# Altium schematic sheet Prophesse Sensor v 1.5.SchDoc: Davis Interface board
size A3; Date: 15/08/2019; DrawnBy: Paras Karki; Organization: ICNS, MARCS Institute; Address1: Werrington South Campus, Great Western Highway; Address2: Werrington, NSW, 2747; DocumentNumber: FN_dav_int; Revision: 1.0; SheetNumber: 1; SheetTotal: 1
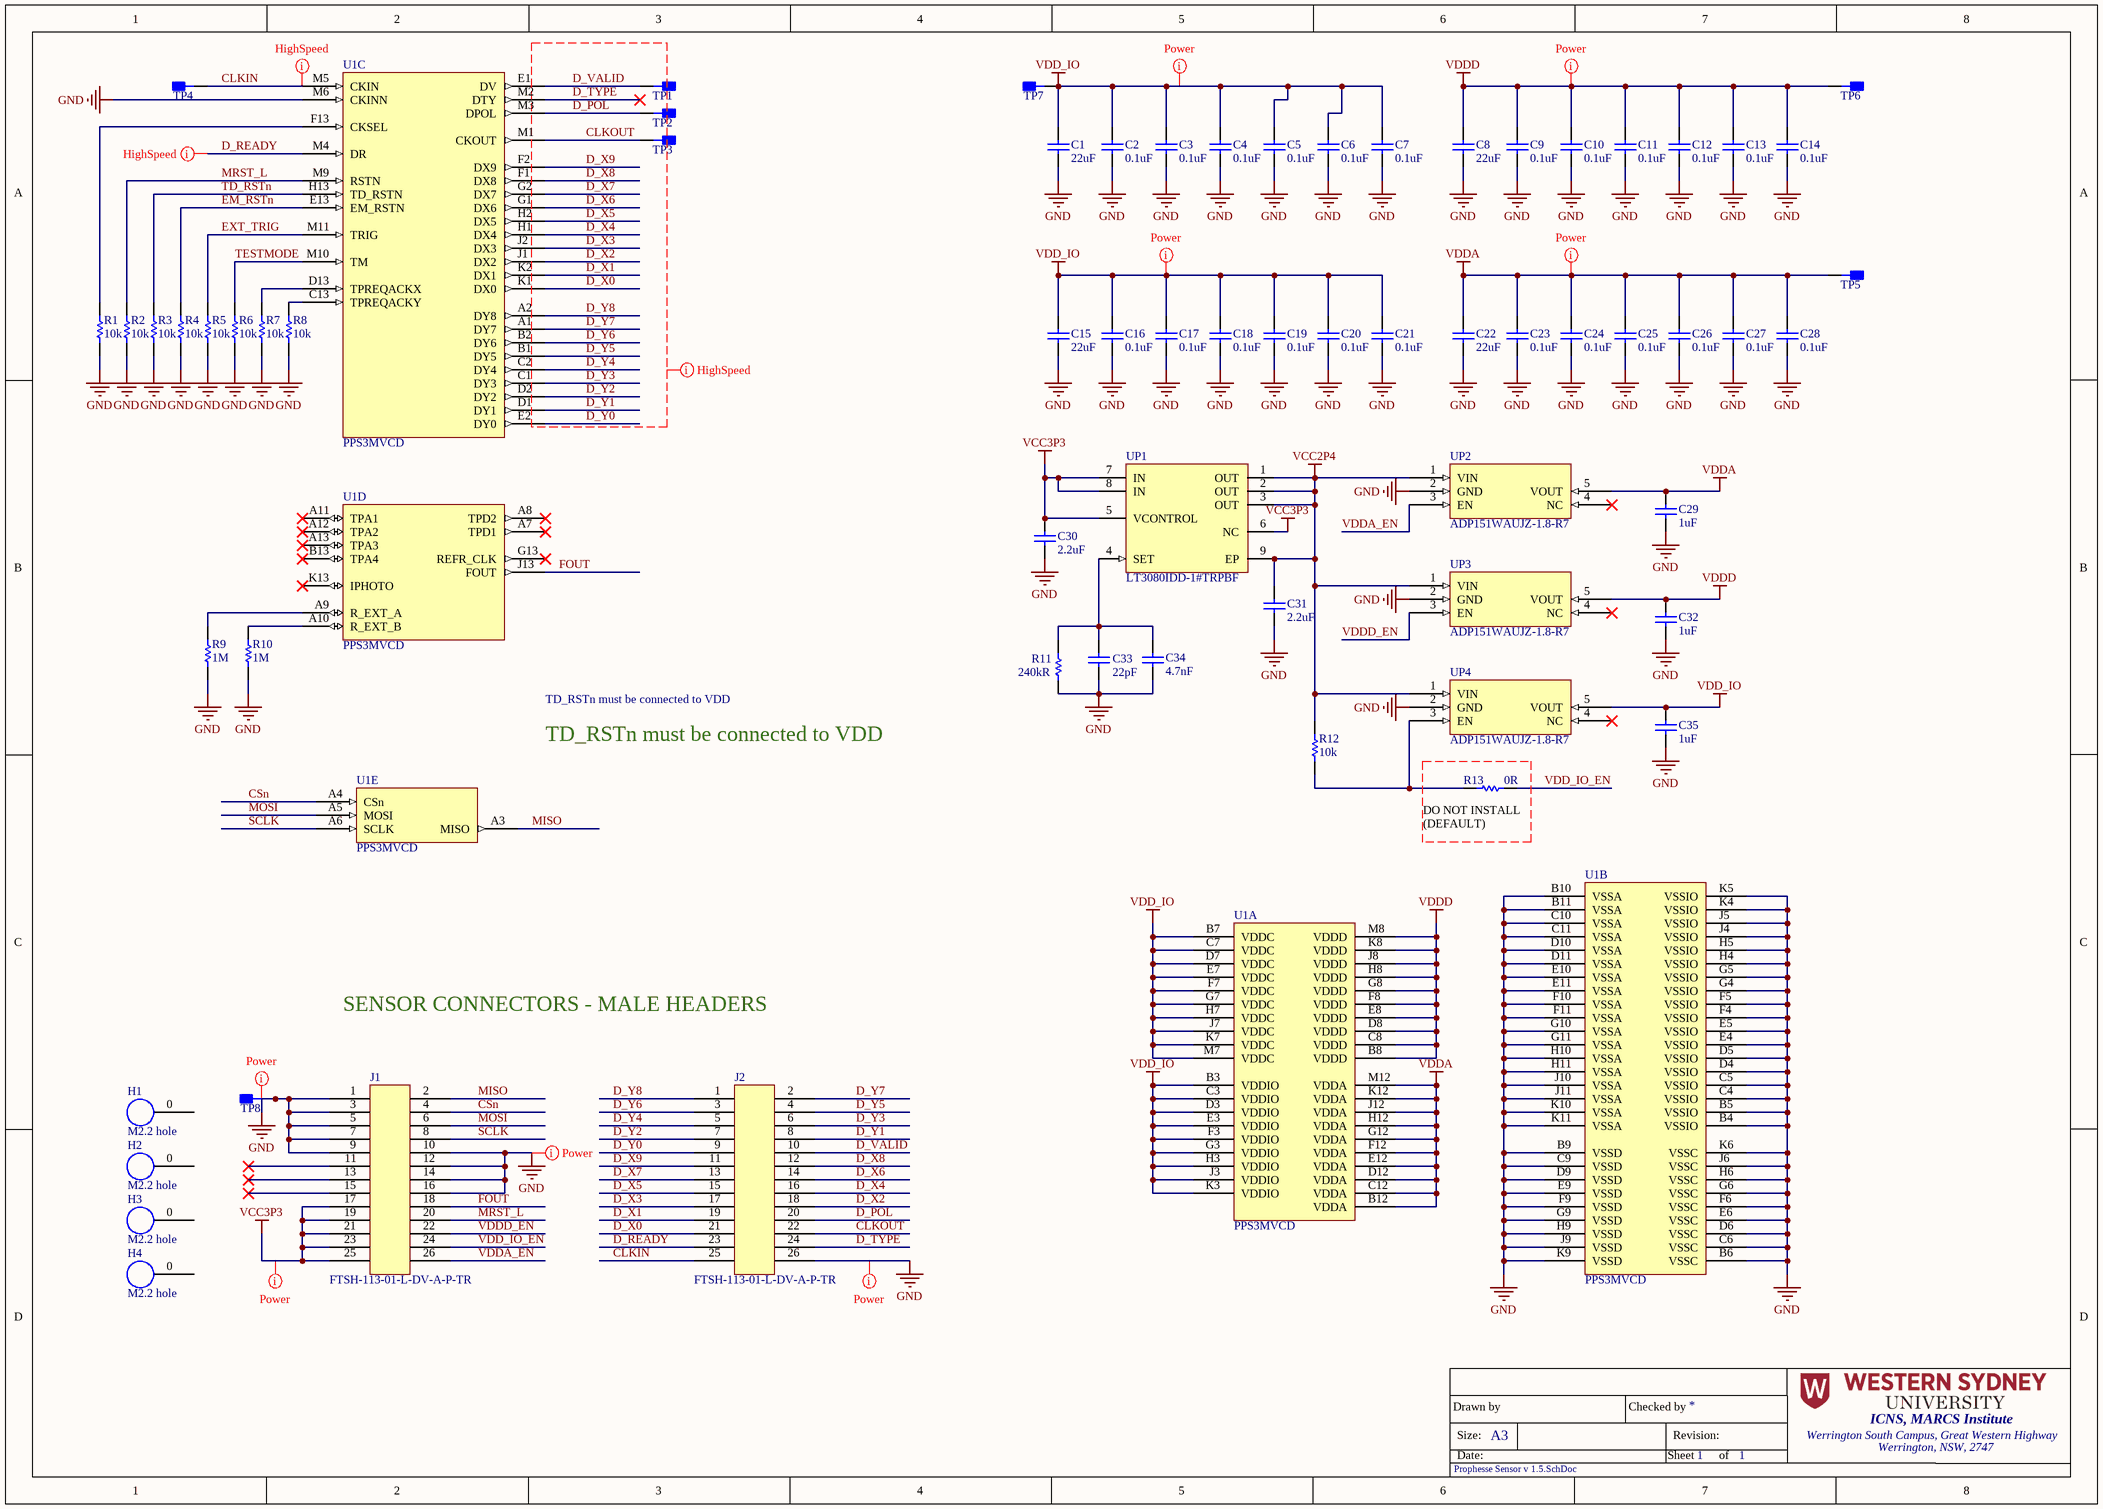
[diagram p0: Prophesse Sensor v 1.5.SchDoc]

## Parts
C1  value 22uF  [CAP 0603 (1608)]  (hidden comment: LMK107BBJ226MA-T)
C2  value 0.1uF  [CAP 0201 (0603)]  (hidden comment: C0201C104K9PACTU)
C3  value 0.1uF  [CAP 0201 (0603)]  (hidden comment: C0201C104K9PACTU)
C4  value 0.1uF  [CAP 0201 (0603)]  (hidden comment: C0201C104K9PACTU)
C5  value 0.1uF  [CAP 0201 (0603)]  (hidden comment: C0201C104K9PACTU)
C6  value 0.1uF  [CAP 0201 (0603)]  (hidden comment: C0201C104K9PACTU)
C7  value 0.1uF  [CAP 0201 (0603)]  (hidden comment: C0201C104K9PACTU)
C8  value 22uF  [CAP 0603 (1608)]  (hidden comment: LMK107BBJ226MA-T)
C9  value 0.1uF  [CAP 0201 (0603)]  (hidden comment: C0201C104K9PACTU)
C10  value 0.1uF  [CAP 0201 (0603)]  (hidden comment: C0201C104K9PACTU)
C11  value 0.1uF  [CAP 0201 (0603)]  (hidden comment: C0201C104K9PACTU)
C12  value 0.1uF  [CAP 0201 (0603)]  (hidden comment: C0201C104K9PACTU)
C13  value 0.1uF  [CAP 0201 (0603)]  (hidden comment: C0201C104K9PACTU)
C14  value 0.1uF  [CAP 0201 (0603)]  (hidden comment: C0201C104K9PACTU)
C15  value 22uF  [CAP 0603 (1608)]  (hidden comment: LMK107BBJ226MA-T)
C16  value 0.1uF  [CAP 0201 (0603)]  (hidden comment: C0201C104K9PACTU)
C17  value 0.1uF  [CAP 0201 (0603)]  (hidden comment: C0201C104K9PACTU)
C18  value 0.1uF  [CAP 0201 (0603)]  (hidden comment: C0201C104K9PACTU)
C19  value 0.1uF  [CAP 0201 (0603)]  (hidden comment: C0201C104K9PACTU)
C20  value 0.1uF  [CAP 0201 (0603)]  (hidden comment: C0201C104K9PACTU)
C21  value 0.1uF  [CAP 0201 (0603)]  (hidden comment: C0201C104K9PACTU)
C22  value 22uF  [CAP 0603 (1608)]  (hidden comment: LMK107BBJ226MA-T)
C23  value 0.1uF  [CAP 0201 (0603)]  (hidden comment: C0201C104K9PACTU)
C24  value 0.1uF  [CAP 0201 (0603)]  (hidden comment: C0201C104K9PACTU)
C25  value 0.1uF  [CAP 0201 (0603)]  (hidden comment: C0201C104K9PACTU)
C26  value 0.1uF  [CAP 0201 (0603)]  (hidden comment: C0201C104K9PACTU)
C27  value 0.1uF  [CAP 0201 (0603)]  (hidden comment: C0201C104K9PACTU)
C28  value 0.1uF  [CAP 0201 (0603)]  (hidden comment: C0201C104K9PACTU)
C29  value 1uF  [CAP 0201 (0603)]  (hidden comment: GRM033R60J105MEA2D)
C30  value 2.2uF  [CAP 0402 (1005)]  (hidden comment: C0402C225K9PAC7867)
C31  value 2.2uF  [CAP 0402 (1005)]  (hidden comment: C0402C225K9PAC7867)
C32  value 1uF  [CAP 0201 (0603)]  (hidden comment: GRM033R60J105MEA2D)
C33  Capacitance: 22pF  [CAP 0603 (1608)]  (hidden comment: GRM1885C1H220JA01D)
C34  value 4.7nF  [CAP 0201 (0603)]  (hidden comment: CC0201KRX7R6BB472)
C35  value 1uF  [CAP 0201 (0603)]  (hidden comment: GRM033R60J105MEA2D)
H1  M2.2 hole  [M2.2 hole]  (no BOM)
H2  M2.2 hole  [M2.2 hole]  (no BOM)
H3  M2.2 hole  [M2.2 hole]  (no BOM)
H4  M2.2 hole  [M2.2 hole]  (no BOM)
J1  FTSH-113-01-L-DV-A-P-TR  [FTSH-113-01-L-DV-A]
J2  FTSH-113-01-L-DV-A-P-TR  [FTSH-113-01-L-DV-A]
R1  value 10k  [RES 0201 (0603)]  (hidden comment: RK73H1HTTC1002F)
R2  value 10k  [RES 0201 (0603)]  (hidden comment: RK73H1HTTC1002F)
R3  value 10k  [RES 0201 (0603)]  (hidden comment: RK73H1HTTC1002F)
R4  value 10k  [RES 0201 (0603)]  (hidden comment: RK73H1HTTC1002F)
R5  value 10k  [RES 0201 (0603)]  (hidden comment: RK73H1HTTC1002F)
R6  value 10k  [RES 0201 (0603)]  (hidden comment: RK73H1HTTC1002F)
R7  value 10k  [RES 0201 (0603)]  (hidden comment: RK73H1HTTC1002F)
R8  value 10k  [RES 0201 (0603)]  (hidden comment: RK73H1HTTC1002F)
R9  value 1M  [RES 0402 (1005)]  (hidden comment: CRCW04021M00DHEDP)
R10  value 1M  [RES 0402 (1005)]  (hidden comment: CRCW04021M00DHEDP)
R11  Resistance: 240kR  [RES 0603 (1608)]  (hidden comment: ERA-3AEB244V)
R12  value 10k  [RES 0201 (0603)]  (hidden comment: RK73H1HTTC1002F)
R13  value 0R  [RES 0402 (1005)]  (hidden comment: RK73Z1ETTP)  (no BOM)
TP1  5015  [FP-5015-MFG]  (value not drawn)
TP2  5015  [FP-5015-MFG]  (value not drawn)
TP3  5015  [FP-5015-MFG]  (value not drawn)
TP4  5015  [FP-5015-MFG]  (value not drawn)
TP5  5015  [FP-5015-MFG]  (value not drawn)
TP6  5015  [FP-5015-MFG]  (value not drawn)
TP7  5015  [FP-5015-MFG]  (value not drawn)
TP8  5015  [FP-5015-MFG]  (value not drawn)
U1  PPS3MVCD  [BPGA142C100P13X11_1500X1300X223_PSS3MVCD]  (parts A,B,C,D,E of 5)
UP1  LT3080IDD-1#TRPBF  [LT-DD-8_V]
UP2  ADP151WAUJZ-1.8-R7  [SOT95P280X100-5N]
UP3  ADP151WAUJZ-1.8-R7  [SOT95P280X100-5N]
UP4  ADP151WAUJZ-1.8-R7  [SOT95P280X100-5N]

## Nets
GND: C1.1 C2.1 C3.1 C4.1 C5.1 C6.1 C7.1 C8.1 C9.1 C10.1 C11.1 C12.1 C13.1 C14.1 C15.1 C16.1 C17.1 C18.1 C19.1 C20.1 C21.1 C22.1 C23.1 C24.1 C25.1 C26.1 C27.1 C28.1 C29.1 C30.2 C31.2 C32.1 C33.2 C34.2 C35.1 J1.1 J1.3 J1.5 J1.7 J1.9 J1.10 J1.12 J1.14 J1.16 J2.26 R1.1 R2.1 R3.1 R4.1 R5.1 R6.1 R7.1 R8.1 R9.1 R10.2 R11.2 TP8.1 U1.B4(VSSIO) U1.B5(VSSIO) U1.B6(VSSC) U1.B9(VSSD) U1.B10(VSSA) U1.B11(VSSA) U1.C4(VSSIO) U1.C5(VSSIO) U1.C6(VSSC) U1.C9(VSSD) U1.C10(VSSA) U1.C11(VSSA) U1.D4(VSSIO) U1.D5(VSSIO) U1.D6(VSSC) U1.D9(VSSD) U1.D10(VSSA) U1.D11(VSSA) U1.E4(VSSIO) U1.E5(VSSIO) U1.E6(VSSC) U1.E9(VSSD) U1.E10(VSSA) U1.E11(VSSA) U1.F4(VSSIO) U1.F5(VSSIO) U1.F6(VSSC) U1.F9(VSSD) U1.F10(VSSA) U1.F11(VSSA) U1.G4(VSSIO) U1.G5(VSSIO) U1.G6(VSSC) U1.G9(VSSD) U1.G10(VSSA) U1.G11(VSSA) U1.H4(VSSIO) U1.H5(VSSIO) U1.H6(VSSC) U1.H9(VSSD) U1.H10(VSSA) U1.H11(VSSA) U1.J4(VSSIO) U1.J5(VSSIO) U1.J6(VSSC) U1.J9(VSSD) U1.J10(VSSA) U1.J11(VSSA) U1.K4(VSSIO) U1.K5(VSSIO) U1.K6(VSSC) U1.K9(VSSD) U1.K10(VSSA) U1.K11(VSSA) U1.M6(CKINN) UP2.2(GND) UP3.2(GND) UP4.2(GND)
VCC2P4: C31.1 R12.2 UP1.1(OUT) UP1.2(OUT) UP1.3(OUT) UP1.9(EP) UP2.1(VIN) UP3.1(VIN) UP4.1(VIN)
VCC3P3: C30.1 J1.17 J1.19 J1.21 J1.23 J1.25 UP1.5(VCONTROL) UP1.6(NC) UP1.7(IN) UP1.8(IN)
VDD_IO: C1.2 C2.2 C3.2 C4.2 C5.2 C6.2 C7.2 C15.2 C16.2 C17.2 C18.2 C19.2 C20.2 C21.2 C35.2 TP7.1 U1.B3(VDDIO) U1.B7(VDDC) U1.C3(VDDIO) U1.C7(VDDC) U1.D3(VDDIO) U1.D7(VDDC) U1.E3(VDDIO) U1.E7(VDDC) U1.F3(VDDIO) U1.F7(VDDC) U1.G3(VDDIO) U1.G7(VDDC) U1.H3(VDDIO) U1.H7(VDDC) U1.J3(VDDIO) U1.J7(VDDC) U1.K3(VDDIO) U1.K7(VDDC) U1.M7(VDDC) UP4.5(VOUT)
VDDA: C22.2 C23.2 C24.2 C25.2 C26.2 C27.2 C28.2 C29.2 TP5.1 U1.B12(VDDA) U1.C12(VDDA) U1.D12(VDDA) U1.E12(VDDA) U1.F12(VDDA) U1.G12(VDDA) U1.H12(VDDA) U1.J12(VDDA) U1.K12(VDDA) U1.M12(VDDA) UP2.5(VOUT)
VDDD: C8.2 C9.2 C10.2 C11.2 C12.2 C13.2 C14.2 C32.2 TP6.1 U1.B8(VDDD) U1.C8(VDDD) U1.D8(VDDD) U1.E8(VDDD) U1.F8(VDDD) U1.G8(VDDD) U1.H8(VDDD) U1.J8(VDDD) U1.K8(VDDD) U1.M8(VDDD) UP3.5(VOUT)
CLKIN: J2.25 TP4.1 U1.M5(CKIN)
CLKOUT: J2.22 TP3.1 U1.M1(CKOUT)
CSn: J1.4 U1.A4(CSn)
D_POL: J2.20 TP2.1 U1.M3(DPOL)
D_READY: J2.23 U1.M4(DR)
D_TYPE: J2.24 U1.M2(DTY)
D_VALID: J2.10 TP1.1 U1.E1(DV)
D_X0: J2.21 U1.K1(DX0)
D_X1: J2.19 U1.K2(DX1)
D_X2: J2.18 U1.J1(DX2)
D_X3: J2.17 U1.J2(DX3)
D_X4: J2.16 U1.H1(DX4)
D_X5: J2.15 U1.H2(DX5)
D_X6: J2.14 U1.G1(DX6)
D_X7: J2.13 U1.G2(DX7)
D_X8: J2.12 U1.F1(DX8)
D_X9: J2.11 U1.F2(DX9)
D_Y0: J2.9 U1.E2(DY0)
D_Y1: J2.8 U1.D1(DY1)
D_Y2: J2.7 U1.D2(DY2)
D_Y3: J2.6 U1.C1(DY3)
D_Y4: J2.5 U1.C2(DY4)
D_Y5: J2.4 U1.B1(DY5)
D_Y6: J2.3 U1.B2(DY6)
D_Y7: J2.2 U1.A1(DY7)
D_Y8: J2.1 U1.A2(DY8)
EM_RSTn: R4.2 U1.E13(EM_RSTN)
EXT_TRIG: R5.2 U1.M11(TRIG)
FOUT: J1.18 U1.J13(FOUT)
MISO: J1.2 U1.A3(MISO)
MOSI: J1.6 U1.A5(MOSI)
MRST_L: J1.20 R2.2 U1.M9(RSTN)
SCLK: J1.8 U1.A6(SCLK)
TD_RSTn: R3.2 U1.H13(TD_RSTN)
TESTMODE: R6.2 U1.M10(TM)
VDD_IO_EN: J1.24 R13.2
VDDA_EN: J1.26 UP2.3(EN)
VDDD_EN: J1.22 UP3.3(EN)
NetC33_1: C33.1 C34.1 R11.1 UP1.4(SET)
NetR1_2: R1.2 U1.F13(CKSEL)
NetR7_2: R7.2 U1.D13(TPREQACKX)
NetR8_2: R8.2 U1.C13(TPREQACKY)
NetR9_2: R9.2 U1.A9(R_EXT_A)
NetR10_1: R10.1 U1.A10(R_EXT_B)
NetR12_1: R12.1 R13.1 UP4.3(EN)

Not connected (* = marked no-connect by the designer): H1 0; H2 0; H3 0; H4 0; J1 11* 13* 15*; U1 A7(TPD1)* A8(TPD2)* A11(TPA1)* A12(TPA2)* A13(TPA3)* B13(TPA4)* G13(REFR_CLK)* K13(IPHOTO)*; UP2 4(NC)*; UP3 4(NC)*; UP4 4(NC)*

## Layout directives
net class HighSpeed: CLKIN, CLKOUT, D_POL, D_READY, D_TYPE, D_VALID, D_X0, D_X1, D_X2, D_X3, D_X4, D_X5, D_X6, D_X7, D_X8, D_X9, D_Y0, D_Y1, D_Y2, D_Y3, D_Y4, D_Y5, D_Y6, D_Y7, D_Y8
net class Power Line: GND, VCC3P3, VDD_IO, VDDA, VDDD

## Notes on the sheet
- TD_RSTn must be connected to VDD
- (near R13) DO NOT INSTALL
  (DEFAULT)
- SENSOR CONNECTORS - MALE HEADERS
- Drawn by
- Size:
- Date:
- A3
- Checked by
- Sheet
- Revision:
- of

## Library data of the parts
C1 C8 C15 C22 = LMK107BBJ226MA-T: LMK107BBJ226MA-T, CAP CER 22UF 10V X5R 0603, 22µF ±20% 10V Ceramic Capacitor X5R 0603 (1608 Metric); Manufacturer: Taiyo Yuden; Manufacturer Part Number: LMK107BBJ226MA-T; Supplier: Digikey; Supplier Part Number: 587-4913-1-ND
C2-C7 C9-C14 C16-C21 C23-C28 = C0201C104K9PACTU: C0201C104K9PACTU, 0.1µF ±10% 6.3V Ceramic Capacitor X5R 0201 (0603 Metric); Manufacturer: KENET; Manufacturer Part Number: C0201C104K9PACTU; Supplier: Digikey; Supplier Part Number: 399-7743-1-ND
C29 C32 C35 = GRM033R60J105MEA2D: GRM033R60J105MEA2D, 1µF ±20% 6.3V Ceramic Capacitor X5R 0201 (0603 Metric); Manufacturer: Murata Electronics; Manufacturer Part Number: GRM033R60J105MEA2D; Supplier: Digikey; Supplier Part Number: 490-7229-1-ND
C30 C31 = C0402C225K9PAC7867: C0402C225K9PAC7867, 2.2µF ±10% 6.3V Ceramic Capacitor X5R 0402 (1005 Metric); Manufacturer: KEMET; Manufacturer Part Number: C0402C225K9PAC7867; Supplier: Digikey; Supplier Part Number: 399-11617-1-ND
C33 = GRM1885C1H220JA01D: CAP CER 22PF 50V C0G/NP0 0603; Manufacturer: Murata; Material: Ceramic; Tolerance: 10%; Dielectric: C0G; Insulation Resistance: 10GR; Temperature Coefficient: 30ppm/°C; Manufacturer Part Number: GRM1885C1H220JA01D; RoHS: Yes; Category: Ceramic Capacitors; Stock 1: 108673; Pricing 1: 1=0.14000, 10=0.06600, 50=0.06600, 100=0.03000, 1000=0.01700, 10000=0.01100 (USD); Mount: Surface Mount; Case/Package: 0603; Number of Pins: 2; Case Code (Metric): 1608; Case Code (Imperial): 0603; Dielectric Material: Ceramic; Min Operating Temperature: -55°C; Max Operating Temperature: 125°C; Package Quantity: 1; Voltage Rating: 50V; Packaging: Tape and Reel; Voltage Rating (DC): 50V; Termination: SMD/SMT; Voltage: 50V; Series: GRM; Construction: Flat; Length: 1.6mm; Width: 0.031inch; Height: 0.8mm; Thickness: 0.035inch; Depth: 0.8mm; Radiation Hardening: No; REACH SVHC: No SVHC; Lead Free: Lead Free; RoHS Compliant: Yes; ComponentLink1URL: https://datasheet.ciiva.com/131/product-131760.pdf?src-supplier=Digi-Key; ComponentLink1Description: https://datasheet.ciiva.com/131/product-131760.pdf?src-supplier=Digi-Key; ComponentLink2URL: https://datasheet.ciiva.com/11786/0900766b807a1cab-11786398.pdf?src-supplier=RSComponents; ComponentLink2Description: https://datasheet.ciiva.com/11786/0900766b807a1cab-11786398.pdf?src-supplier=RSComponents; ComponentLink3URL: https://datasheet.ciiva.com/3776/1156grm1885c1h220ja0123-3776984.pdf?src-supplier=Arrow+Electronics; ComponentLink3Description: https://datasheet.ciiva.com/3776/1156grm1885c1h220ja0123-3776984.pdf?src-supplier=Arrow+Electronics; ComponentLink4URL: https://datasheet.ciiva.com/14116/grmseries-tc-hitype-eng-14116853.pdf?src-supplier=Distrelec; ComponentLink4Description: https://datasheet.ciiva.com/14116/grmseries-tc-hitype-eng-14116853.pdf?src-supplier=Distrelec; ComponentLink5URL: https://datasheet.ciiva.com/14116/grmseries-tc-hitype-eng-14116826.pdf?src-supplier=Distrelec; ComponentLink5Description: https://datasheet.ciiva.com/14116/grmseries-tc-hitype-eng-14116826.pdf?src-supplier=Distrelec; ComponentLink6URL: https://datasheet.ciiva.com/131/partnumbering-e-01-131759.pdf?src-supplier=Digi-Key; ComponentLink6Description: https://datasheet.ciiva.com/131/partnumbering-e-01-131759.pdf?src-supplier=Digi-Key; ComponentLink7URL: https://datasheet.ciiva.com/131/partnumbering-e-01-131761.pdf?src-supplier=Digi-Key; ComponentLink7Description: https://datasheet.ciiva.com/131/partnumbering-e-01-131761.pdf?src-supplier=Digi-Key; Value: 22pF; Supplier 1: Mouser; Supplier Part Number 1: 81-GRM39C220J50; Supplier 2: Digi-Key; Supplier Part Number 2: 490-1411-1-ND; Supplier 3: Future Electronics; Supplier Part Number 3: 4343497; Supplier 4: Arrow Electronics; Supplier Part Number 4: GRM1885C1H220JA01D
C34 = CC0201KRX7R6BB472: CC0201KRX7R6BB472, 4700pF ±10% 10V Ceramic Capacitor X7R 0201 (0603 Metric); Manufacturer: Yageo; Manufacturer Part Number: CC0201KRX7R6BB472; Supplier: Digikey; Supplier Part Number: 311-1405-1-ND
H1-H4 = M2.2 hole: M2.2 through hole not plated
J1 J2 = FTSH-113-01-L-DV-A-P-TR: Connector Header Surface Mount 26 position 0.050" (1.27mm) 2 Rows Alignment Pin; Manufacturer: Samtec; Number of Contacts: 26; Gender: Male; Connector Type: Male Pin; Pitch: 0.05inch; Manufacturer Part Number: FTSH-113-01-L-DV-A-P-TR; RoHS: Yes; Category: Headers and Wire Housings; Stock 1: 375; Pricing 1: 1=7.90000, 10=7.57000, 50=7.57000, 100=6.25000, 375=5.26000, 750=4.60000, 1000=4.60000, 2250=4.37000, 4875=4.27000, 9750=4.17000, 10000=4.60000 (USD); Mount: Surface Mount; Contact Plating: Gold; Contact Material: Bronze; Color: Black; Packaging: Tape and Reel; Number of Rows: 2; Termination: Solder; Number of Positions: 26; Series: FTSH; Contact Type: Male Pin; Row Spacing: 0.05inch; Contact Mating Length: 0.12inch; Lead Free: Lead Free; RoHS Compliant: Yes; ComponentLink1URL: https://datasheet.ciiva.com/738/ftsh-1xx-xx-xxx-dv-xxx-mkt-738891.pdf?src-supplier=Digi-Key; ComponentLink1Description: https://datasheet.ciiva.com/738/ftsh-1xx-xx-xxx-dv-xxx-mkt-738891.pdf?src-supplier=Digi-Key; Supplier 1: Mouser; Supplier Part Number 1: 200-FTSH11301LDVAPTR; Supplier 2: Digi-Key; Supplier Part Number 2: SAM13967CT-ND
R1-R8 R12 = RK73H1HTTC1002F: RK73H1HTTC1002F, RES 10K OHM 1% 1/20W 0201, 10 kOhms ±1% 0.05W, 1/20W Chip Resistor 0201 (0603 Metric) Automotive AEC-Q200, Moisture Resistant Thick Film; Manufacturer: KOA Speer Electronics, Inc.; Manufacturer Part Number: RK73H1HTTC1002F; Supplier: Digikey; Supplier Part Number: 2019-RK73H1HTTC1002FCT-ND
R9 R10 = CRCW04021M00DHEDP: CRCW04021M00DHEDP, RES SMD 1M OHM 0.5% 1/16W 0402, 1 MOhms ±0.5% 0.063W, 1/16W Chip Resistor 0402 (1005 Metric) Automotive AEC-Q200 Thick Film; Manufacturer: Vishay Dale; Manufacturer Part Number: CRCW04021M00DHEDP; Supplier: Digikey; Supplier Part Number: 541-1.0MAVCT-ND
R11 = ERA-3AEB244V: Res Thin Film 0603 240K Ohm 0.1% 1/10W ±25ppm/°C Molded SMD SMD Punched Carrier T/R; Manufacturer: Panasonic; Power Rating: 100mW; Voltage Rating: 75V; Supplier 1: Newark; Supplier Part Number 1: 54W2563; Manufacturer Part Number: ERA-3AEB244V; RoHS: Yes; Category: Chip SMD Resistors; Stock 1: 209; Pricing 1: 1=0.35700, 25=0.30700, 50=0.21600, 100=0.12400, 250=0.10000, 500=0.07500, 1000=0.05100 (USD); Mount: Surface Mount; Case/Package: 0603; Number of Pins: 2; Contact Plating: Tin; Case Code (Metric): 1608; Case Code (Imperial): 0603; Min Operating Temperature: -55°C; Max Operating Temperature: 155°C; Tolerance: 0.1%; Resistor Type: Thin Film,Metal Film; Temperature Coefficient: 25ppm/°C; Packaging: Tape and Reel; Package Quantity: 1; Number of Terminations: 2; Termination: SMD/SMT; Max Power Dissipation: 100mW; Voltage Rating (DC): 75V; Features: Automotive AEC-Q200; Series: ERA-3A; Resistance Tolerance: 0.1%; Construction: Rectangular; Technology: THIN FILM; Length: 1.6mm; Width: 0.8mm; Height: 0.45mm; Depth: 0.8mm; Radiation Hardening: No; REACH SVHC: No SVHC; Military Standard: Not; Lead Free: Lead Free; RoHS Compliant: Yes; ComponentLink1URL: https://datasheet.ciiva.com/29183/451796-da-01-en-widerstand-0603-era-29183893.pdf?src-supplier=Conrad; ComponentLink1Description: https://datasheet.ciiva.com/29183/451796-da-01-en-widerstand-0603-era-29183893.pdf?src-supplier=Conrad; ComponentLink2URL: https://datasheet.ciiva.com/9183/aoa0000ce26-9183976.pdf?src-supplier=Avnet; ComponentLink2Description: https://datasheet.ciiva.com/9183/aoa0000ce26-9183976.pdf?src-supplier=Avnet; ComponentLink3URL: https://datasheet.ciiva.com/5998/485442-5998798.pdf?src-supplier=Farnell; ComponentLink3Description: https://datasheet.ciiva.com/5998/485442-5998798.pdf?src-supplier=Farnell; ComponentLink4URL: https://datasheet.ciiva.com/43457/485442-43457866.pdf?src-supplier=Farnell; ComponentLink4Description: https://datasheet.ciiva.com/43457/485442-43457866.pdf?src-supplier=Farnell; ComponentLink5URL: https://datasheet.ciiva.com/9117/aoa0000ce26-9117644.pdf?src-supplier=Avnet; ComponentLink5Description: https://datasheet.ciiva.com/9117/aoa0000ce26-9117644.pdf?src-supplier=Avnet; ComponentLink6URL: https://datasheet.ciiva.com/30256/54aoa0000ce26-30256268.pdf?src-supplier=Onlinecomponents.com; ComponentLink6Description: https://datasheet.ciiva.com/30256/54aoa0000ce26-30256268.pdf?src-supplier=Onlinecomponents.com; ComponentLink7URL: https://datasheet.ciiva.com/48425/era-eng-tds-48425446.pdf?src-supplier=Distrelec; ComponentLink7Description: https://datasheet.ciiva.com/48425/era-eng-tds-48425446.pdf?src-supplier=Distrelec; ComponentLink8URL: https://datasheet.ciiva.com/22712/485442-22712861.pdf?src-supplier=Element14; ComponentLink8Description: https://datasheet.ciiva.com/22712/485442-22712861.pdf?src-supplier=Element14; ComponentLink9URL: https://datasheet.ciiva.com/22712/485442-22712862.pdf?src-supplier=Element14; ComponentLink9Description: https://datasheet.ciiva.com/22712/485442-22712862.pdf?src-supplier=Element14; ComponentLink10URL: https://datasheet.ciiva.com/48530/era-eng-tds-48530397.pdf?src-supplier=Distrelec; ComponentLink10Description: https://datasheet.ciiva.com/48530/era-eng-tds-48530397.pdf?src-supplier=Distrelec; ComponentLink11URL: https://datasheet.ciiva.com/46390/485442-46390460.pdf?src-supplier=Element14; ComponentLink11Description: https://datasheet.ciiva.com/46390/485442-46390460.pdf?src-supplier=Element14; Value: 240K
R13 = RK73Z1ETTP: RK73Z1ETTP, 0 Ohms Jumper  Chip Resistor 0402 (1005 Metric) Automotive AEC-Q200, Moisture Resistant Metal Element; Manufacturer: KOA Speer Electronics, Inc.; Manufacturer Part Number: RK73Z1ETTP; Supplier: Digikey; Supplier Part Number: 2019-RK73Z1ETTPCT-ND
TP1-TP8 = 5015: PC TEST POINT MINIATURE SMT; Manufacturer: Keystone Electronics; Number of Ports: 1; Manufacturer Part Number: 5015; RoHS: Yes; Category: Connectors; Stock 1: 274000; Pricing 1: 1=0.12900, 1000=0.12400, 2000=0.11800, 4000=0.11600, 6000=0.11300 (USD); Mount: Surface Mount; Contact Material: Bronze; Contact Plating: Silver,Tin,Lead; Color: White; Material: Bronze,Silver; Package Quantity: 1; Packaging: Tape and Reel; Termination: Solder; Orientation: Straight; Series: -; Length: 2.66mm; Height: 0.06inch; Depth: 1.01mm; Thickness: 0.01inch; REACH SVHC: No SVHC; RoHS Compliant: Yes; Lead Free: Lead Free; ComponentLink1URL: https://datasheet.ciiva.com/1123/5015-1123862.pdf?src-supplier=Newark; ComponentLink1Description: https://datasheet.ciiva.com/1123/5015-1123862.pdf?src-supplier=Newark; ComponentLink2URL: https://datasheet.ciiva.com/2917/5015-2917616.pdf?src-supplier=Digi-Key; ComponentLink2Description: https://datasheet.ciiva.com/2917/5015-2917616.pdf?src-supplier=Digi-Key; ComponentLink3URL: https://datasheet.ciiva.com/2917/5015-2917617.pdf?src-supplier=Digi-Key; ComponentLink3Description: https://datasheet.ciiva.com/2917/5015-2917617.pdf?src-supplier=Digi-Key; ComponentLink4URL: https://datasheet.ciiva.com/16883/70182998-16883734.pdf?src-supplier=Allied+Electronics; ComponentLink4Description: https://datasheet.ciiva.com/16883/70182998-16883734.pdf?src-supplier=Allied+Electronics; Supplier 1: Mouser; Supplier Part Number 1: 534-5015; Supplier 2: Digi-Key; Supplier Part Number 2: 36-5015CT-ND; Supplier 3: Newark; Supplier Part Number 3: 21J7580; Supplier 4: Future Electronics; Supplier Part Number 4: 9775289; Supplier 5: Element14; Supplier Part Number 5: 1241806; Supplier 6: Arrow Electronics; Supplier Part Number 6: 5015
U1 = PPS3MVCD: Prophesse Sensor V3M; Manufacturer: Prophesse; Manufacturer Part Number: PPS3MVCD
UP1 = LT3080IDD-1#TRPBF: Linear Voltage Regulator IC Positive Adjustable 1 Output 1.1A 8-DFN (3x3); Manufacturer: Analog Devices / Linear Technology; Dropout Voltage: 1.35V; Output Voltage: 36V; Min Input Voltage: 1.2V; Number of Regulators: 1; Operating Supply Current: 300uA; RoHS: Yes; Stock 1: 3032; Pricing 1: 1=6.49000, 10=5.82800, 25=5.50920, 100=4.77480, 250=4.52992, 500=4.06468, 1000=3.81150 (USD); Case/Package: DFN; Number of Pins: 8; Min Operating Temperature: -40°C; Max Operating Temperature: 125°C; Output Current: 1.1A; Package Quantity: 2500; Packaging: Tape and Reel; Max Input Voltage: 36V; Min Current Limit: 1.1A; RoHS Compliant: Yes; ComponentLink1URL: http://components.arrow.com/part/dataview/51580031S9112172N7433?src-supplier=Arrow+Electronics; ComponentLink1Description: http://components.arrow.com/part/dataview/51580031S9112172N7433?src-supplier=Arrow+Electronics; ComponentLink2URL: http://www.linear.com/docs/26174?src-supplier=Digi-Key; ComponentLink2Description: http://www.linear.com/docs/26174?src-supplier=Digi-Key; Supplier Part Number 1: LT3080IDD-1#TRPBFCT-ND; Supplier 1: Digi-Key; Category: Voltage Regulators - Linear; Manufacturer Part Number: LT3080IDD-1#TRPBF; Supplier 2: Mouser; Supplier Part Number 2: 584-LT3080IDD-1#PBF; Supplier 3: Digi-Key; Supplier Part Number 3: LT3080IDD-1#PBF-ND; Supplier 4: Arrow Electronics; Supplier Part Number 4: LT3080IDD-1
UP2-UP4 = ADP151WAUJZ-1.8-R7: LDO Regulator Pos 1.8V 0.2A Automotive 5-Pin TSOT T/R; Manufacturer: Analog Devices; Manufacturer Part Number: ADP151WAUJZ-1.8-R7; RoHS: Yes; Category: Uncategorized; Stock 1: 251; Pricing 1: 1=1.97000, 10=1.77000, 50=1.67000, 100=1.43000, 1000=0.96900, 10000=0.94400 (USD); Supplier 1: Mouser; Supplier Part Number 1: 584-P151WAUJZ-1.8-R7; Supplier 2: Digi-Key; Supplier Part Number 2: 505-ADP151WAUJZ-1.8-R7CT-ND; Supplier 3: Arrow Electronics; Supplier Part Number 3: ADP151WAUJZ-1.8-R7